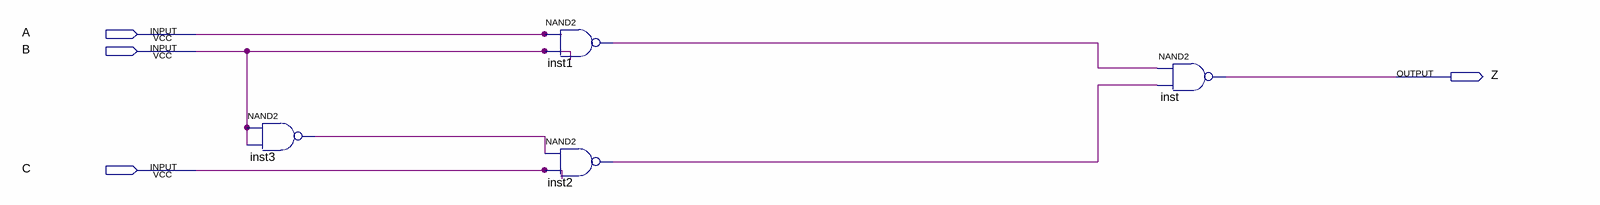
[diagram p0: schematic sheet]
// Quartus schematic lab1_without_hazard.bdf as structural Verilog: 4 symbols, 4 pins
module lab1_without_hazard (
  input  A,
  input  B,
  input  C,
  output Z
);

  wire inst1_out, inst2_out, inst3_out;

  nand inst3 (inst3_out, B, B);
  nand inst1 (inst1_out, A, B);
  nand inst2 (inst2_out, inst3_out, C);
  nand inst (Z, inst1_out, inst2_out);
endmodule
